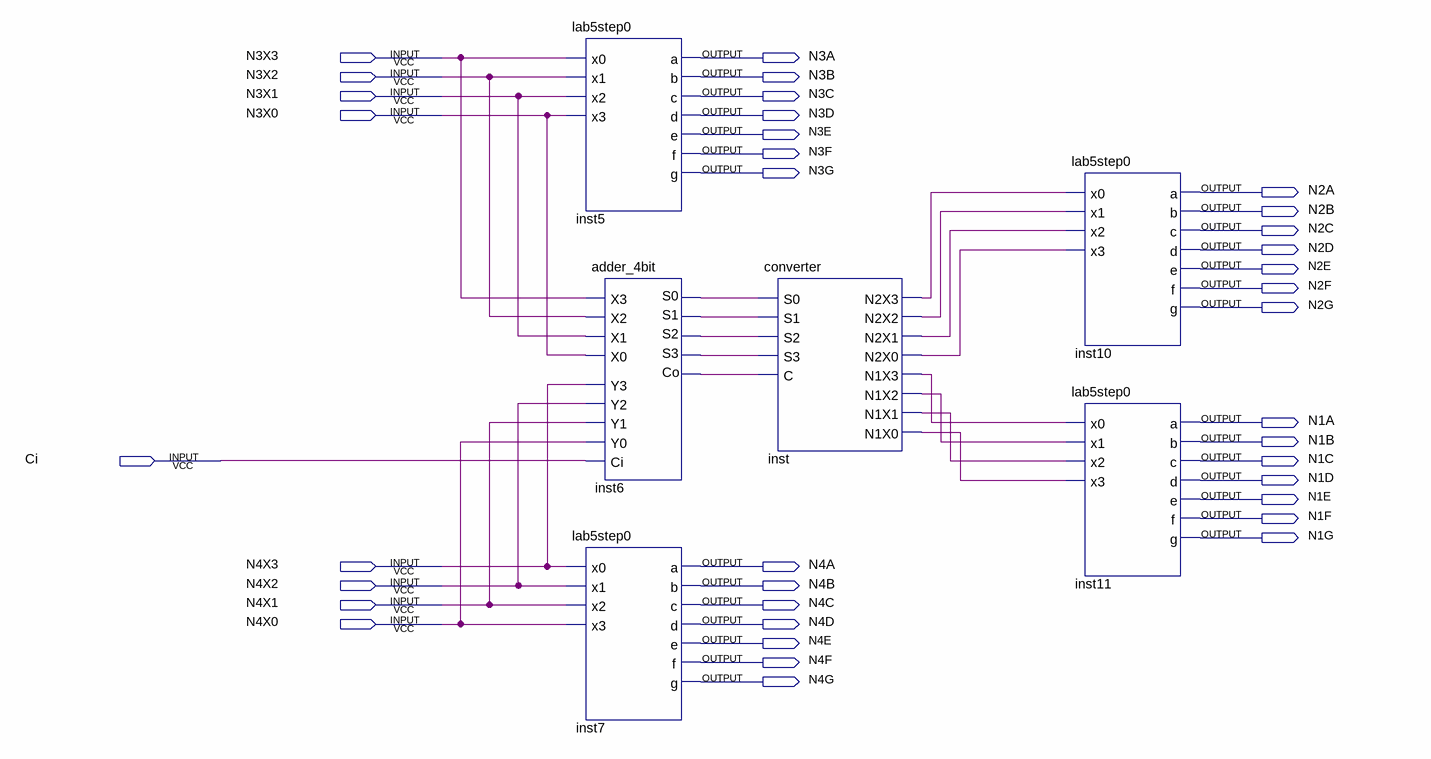
[diagram p0: schematic sheet]
// Quartus schematic lab6.bdf as structural Verilog: 6 symbols, 37 pins
module lab6 (
  input  N3X3,
  input  N3X2,
  input  N3X1,
  input  N3X0,
  input  Ci,
  input  N4X3,
  input  N4X2,
  input  N4X1,
  input  N4X0,
  output N3A,
  output N3B,
  output N3C,
  output N3D,
  output N3E,
  output N3F,
  output N3G,
  output N2A,
  output N2B,
  output N2C,
  output N2D,
  output N2E,
  output N2F,
  output N2G,
  output N1A,
  output N1B,
  output N1C,
  output N1D,
  output N1E,
  output N1F,
  output N1G,
  output N4A,
  output N4B,
  output N4C,
  output N4D,
  output N4E,
  output N4F,
  output N4G
);

  wire inst6_co, inst6_s0, inst6_s1, inst6_s2, inst6_s3, inst_n1x0, inst_n1x1, inst_n1x2, inst_n1x3,
       inst_n2x0, inst_n2x1, inst_n2x2, inst_n2x3;

  lab5step0 inst5 (
    .x0(N3X3), .x1(N3X2), .x2(N3X1), .x3(N3X0), .a(N3A), .b(N3B), .c(N3C), .d(N3D), .e(N3E), .f(N3F), .g(N3G));
  adder_4bit inst6 (
    .X3(N3X3), .Y3(N4X3), .X2(N3X2), .Y2(N4X2), .X1(N3X1), .Y1(N4X1), .X0(N3X0), .Y0(N4X0), .Ci(Ci),
    .S0(inst6_s0), .S1(inst6_s1), .S2(inst6_s2), .S3(inst6_s3), .Co(inst6_co));
  lab5step0 inst7 (
    .x0(N4X3), .x1(N4X2), .x2(N4X1), .x3(N4X0), .a(N4A), .b(N4B), .c(N4C), .d(N4D), .e(N4E), .f(N4F), .g(N4G));
  converter inst (
    .S0(inst6_s0), .S1(inst6_s1), .S2(inst6_s2), .S3(inst6_s3), .C(inst6_co), .N2X3(inst_n2x3),
    .N2X2(inst_n2x2), .N2X1(inst_n2x1), .N2X0(inst_n2x0), .N1X3(inst_n1x3), .N1X2(inst_n1x2),
    .N1X1(inst_n1x1), .N1X0(inst_n1x0));
  lab5step0 inst10 (
    .x0(inst_n2x3), .x1(inst_n2x2), .x2(inst_n2x1), .x3(inst_n2x0), .a(N2A), .b(N2B), .c(N2C), .d(N2D),
    .e(N2E), .f(N2F), .g(N2G));
  lab5step0 inst11 (
    .x0(inst_n1x3), .x1(inst_n1x2), .x2(inst_n1x1), .x3(inst_n1x0), .a(N1A), .b(N1B), .c(N1C), .d(N1D),
    .e(N1E), .f(N1F), .g(N1G));
endmodule
